# EAGLE design ME433_BB_SCHEM (EAGLE 9.6.2)
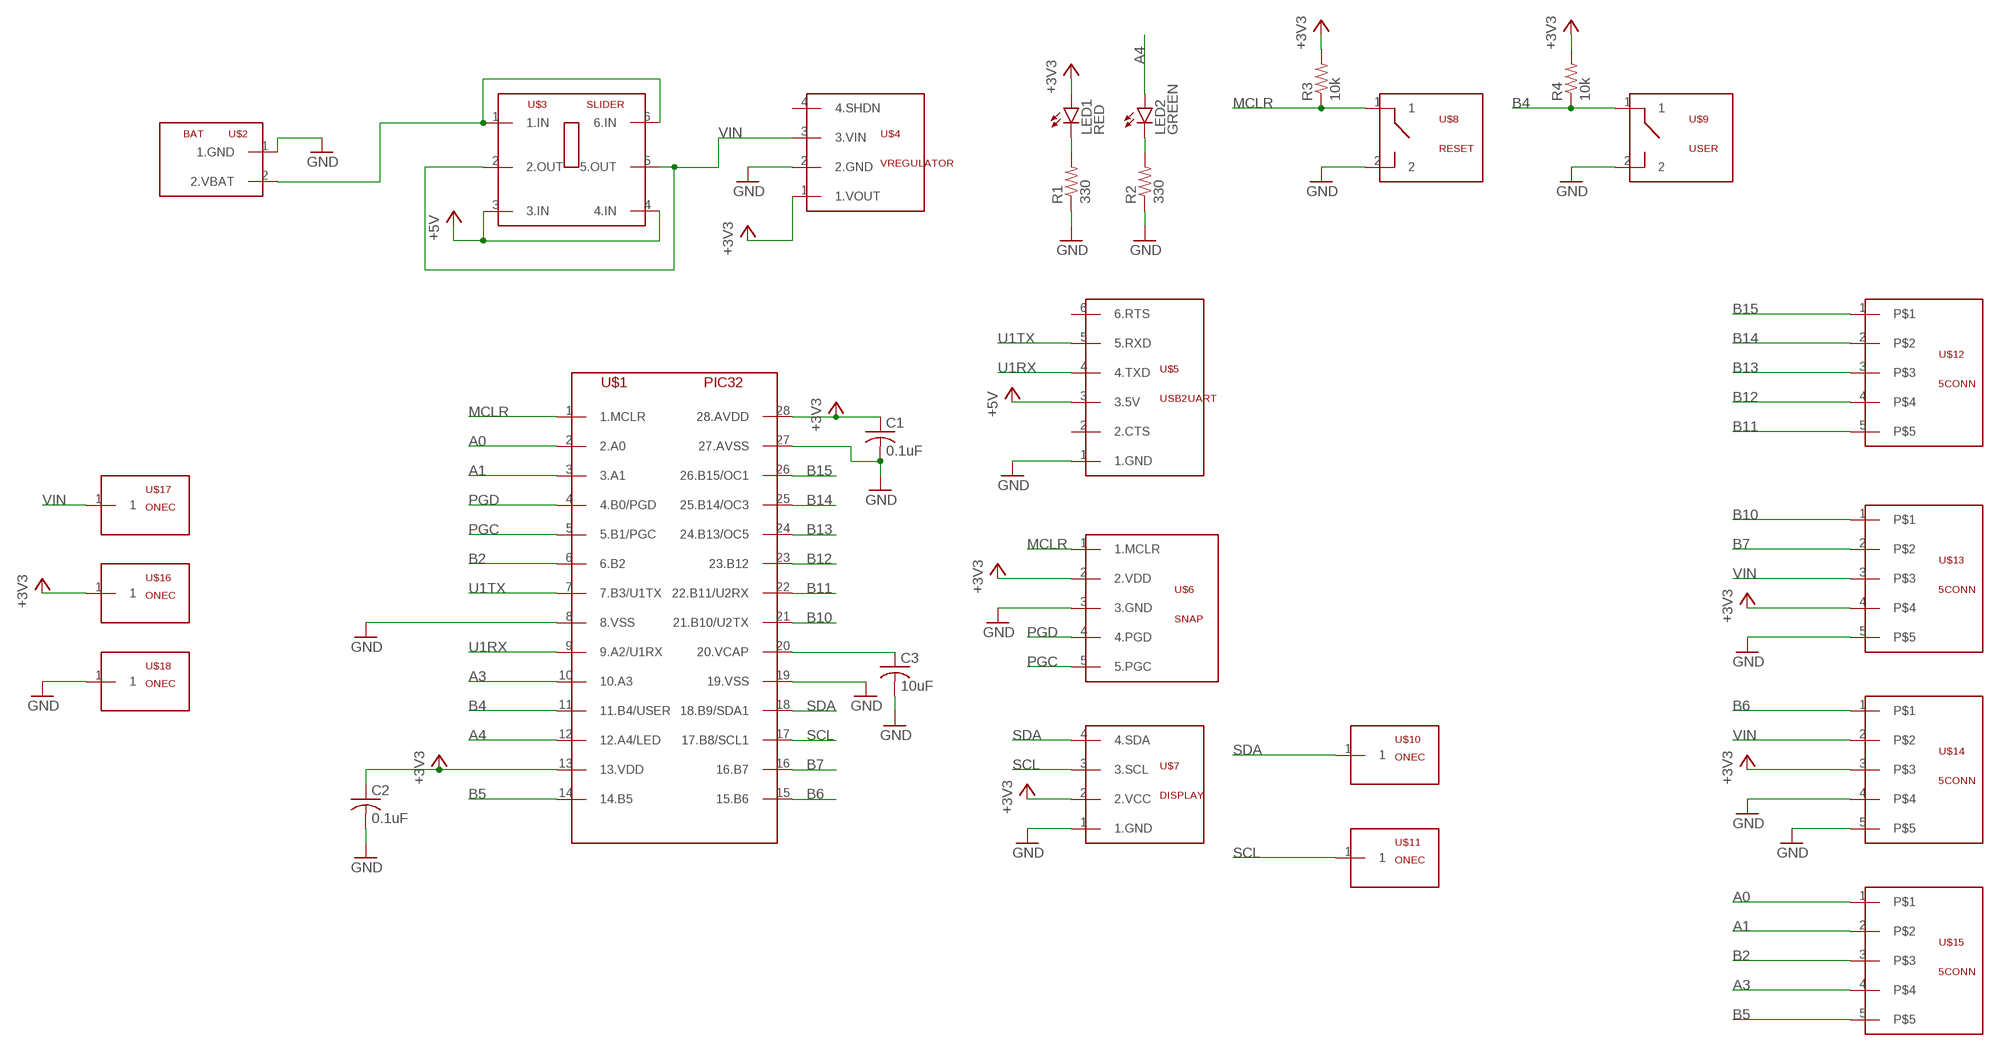
[diagram p0: schematic, sheet 1]

## Parts
C1  0.1uF  C-US025-024X044  [C025-024X044]
C2  0.1uF  C-US025-024X044  [C025-024X044]
C3  10uF  C-US025-024X044  [C025-024X044]
LED1  RED  LED3MM  [LED3MM]
LED2  GREEN  LED3MM  [LED3MM]
R1  330  R-US_0207/7  [0207/7]
R2  330  R-US_0207/7  [0207/7]
R3  10k  R-US_0207/7  [0207/7]
R4  10k  R-US_0207/7  [0207/7]
U$1  PIC32  [DIL28-3]
U$2  BAT  [BAT]
U$3  SLIDER  [SLIDER]
U$4  VREGULATOR  [VREGULATOR]
U$5  USB2UART  [USB2UART]
U$6  SNAP  [SNAP]
U$7  DISPLAY  [DISPLAY]
U$8  RESET  BUTT  [BUTT]
U$9  USER  BUTT  [BUTT]
U$10  ONEC  [ONEC]
U$11  ONEC  [ONEC]
U$12  5CONN  [5CONN]
U$13  5CONN  [5CONN]
U$14  5CONN  [5CONN]
U$15  5CONN  [5CONN]
U$16  ONEC  [ONEC]
U$17  ONEC  [ONEC]
U$18  ONEC  [ONEC]

## Nets
+3V3: C1.1 C2.1 LED1.A R3.2 R4.2 U$1.13(13.VDD) U$1.28(28.AVDD) U$4.1(1.VOUT) U$6.2(2.VDD) U$7.2(2.VCC) U$13.4 U$14.3 U$16.1
+5V: U$3.3(3.IN) U$3.4(4.IN) U$5.3(3.5V)
A0: U$1.2(2.A0) U$15.1
A1: U$1.3(3.A1) U$15.2
A3: U$1.10(10.A3) U$15.4
A4: LED2.A U$1.12(12.A4/LED)
B2: U$1.6(6.B2) U$15.3
B4: R4.1 U$1.11(11.B4/USER) U$9.1
B5: U$1.14(14.B5) U$15.5
B6: U$1.15(15.B6) U$14.1
B7: U$1.16(16.B7) U$13.2
B10: U$1.21(21.B10/U2TX) U$13.1
B11: U$1.22(22.B11/U2RX) U$12.5
B12: U$1.23(23.B12) U$12.4
B13: U$1.24(24.B13/OC5) U$12.3
B14: U$1.25(25.B14/OC3) U$12.2
B15: U$1.26(26.B15/OC1) U$12.1
GND: C1.2 C2.2 C3.2 R1.1 R2.1 U$1.8(8.VSS) U$1.19(19.VSS) U$1.27(27.AVSS) U$2.1(1.GND) U$4.2(2.GND) U$5.1(1.GND) U$6.3(3.GND) U$7.1(1.GND) U$8.2 U$9.2 U$13.5 U$14.4 U$14.5 U$18.1
MCLR: R3.1 U$1.1(1.MCLR) U$6.1(1.MCLR) U$8.1
N$1: LED1.K(C) R1.2
N$2: U$2.2(2.VBAT) U$3.1(1.IN) U$3.6(6.IN)
N$3: LED2.K(C) R2.2
N$5: C3.1 U$1.20(20.VCAP)
PGC: U$1.5(5.B1/PGC) U$6.5(5.PGC)
PGD: U$1.4(4.B0/PGD) U$6.4(4.PGD)
SCL: U$1.17(17.B8/SCL1) U$7.3(3.SCL) U$11.1
SDA: U$1.18(18.B9/SDA1) U$7.4(4.SDA) U$10.1
U1RX: U$1.9(9.A2/U1RX) U$5.4(4.TXD)
U1TX: U$1.7(7.B3/U1TX) U$5.5(5.RXD)
VIN: U$3.2(2.OUT) U$3.5(5.OUT) U$4.3(3.VIN) U$13.3 U$14.2 U$17.1
Unconnected: U$4.4(4.SHDN) U$5.2(2.CTS) U$5.6(6.RTS)

## Library data of the parts
C1-C3 = ME433_BB_library:C-US: CAPACITOR, American symbol; SPICEPREFIX: C
LED1 LED2 = ME433_BB_library:LED: LED OSRAM: - CHIPLED LG R971, LG N971, LY N971, LG Q971, LY Q971, LO R971, LY R971 LH N974, LH R974 LS Q976, LO Q976, LY Q976 LO Q996 - Hyper CHIPLED LW Q18S LB Q993, LB Q99A, LB R99A - SideLED LS A670, LO A670, LY A670, LG A670, LP A670 LB A673, LV A673, LT A673, LW A673 LH A674 LY A675 LS A676, LA A676, LO A676, LY A676, LW A676 LS A679, LY A679, LG A679 - Hyper Micro SIDELED® LS Y876, LA Y876, LO Y876, LY Y876 LT Y87S - SmartLED LW L88C, LW L88S LB L89C, LB L89S, LG L890 LS L89K, LO L89K, LY L89K LS L896, LA L896, LO L896, LY L896 - TOPLED LS T670, LO T670, LY T670, LG T670, LP T670 LSG T670, LSP T670, LSY T670, LOP T670, LYG T670 LG T671, LOG T671, LSG T671 LB T673, LV T673, LT T673, LW T673 LH T674 LS T676, LA T676, LO T676, LY T676, LB T676, LH T676, LSB T676, LW T676 LB T67C, LV T67C, LT T67C, LS T67K, LO T67K, LY T67K, LW E67C LS E67B, LA E67B, LO E67B, LY E67B, LB E67C, LV E67C, LT E67C LW T67C LS T679, LY T679, LG T679 LS T770, LO T770, LY T770, LG T770, LP T770 LB T773, LV T773, LT T773, LW T773 LH T774 LS E675, LA E675, LY E675, LS T675 LS T776, LA T776, LO T776, LY T776, LB T776 LHGB T686 LT T68C, LB T68C - Hyper Mini TOPLED® LB M676 - Mini TOPLED Santana® LG M470 LS M47K, LO M47K, LY M47K Source: http://www.osram.convergy.de LUXEON: - LUMILED® LXK2-PW12-R00, LXK2-PW12-S00, LXK2-PW14-U00, LXK2-PW14-V00 LXK2-PM12-R00, LXK2-PM12-S00, LXK2-PM14-U00 LXK2-PE12-Q00, LXK2-PE12-R00, LXK2-PE12-S00, LXK2-PE14-T00, LXK2-PE14-U00 LXK2-PB12-K00, LXK2-PB12-L00, LXK2-PB12-M00, LXK2-PB14-N00, LXK2-PB14-P00, LXK2-PB14-Q00 LXK2-PR12-L00, LXK2-PR12-M00, LXK2-PR14-Q00, LXK2-PR14-R00 LXK2-PD12-Q00, LXK2-PD12-R00, LXK2-PD12-S00 LXK2-PH12-R00, LXK2-PH12-S00 LXK2-PL12-P00, LXK2-PL12-Q00, LXK2-PL12-R00 Source: www.luxeon.com KINGBRIGHT: KA-3528ASYC Source: www.kingbright.com
R1-R4 = ME433_BB_library:R-US_: RESISTOR, American symbol; SPICEPREFIX: R
U$1 = ME433_BB_library:PIC32
U$2 = ME433_BB_library:BAT
U$3 = ME433_BB_library:SLIDER
U$4 = ME433_BB_library:VREGULATOR
U$5 = ME433_BB_library:USB2UART
U$6 = ME433_BB_library:SNAP
U$7 = ME433_BB_library:DISPLAY
U$8 U$9 = ME433_BB_library:BUTT
U$10 U$11 U$16-U$18 = ME433_BB_library:ONEC
U$12-U$15 = ME433_BB_library:5CONN

## Board
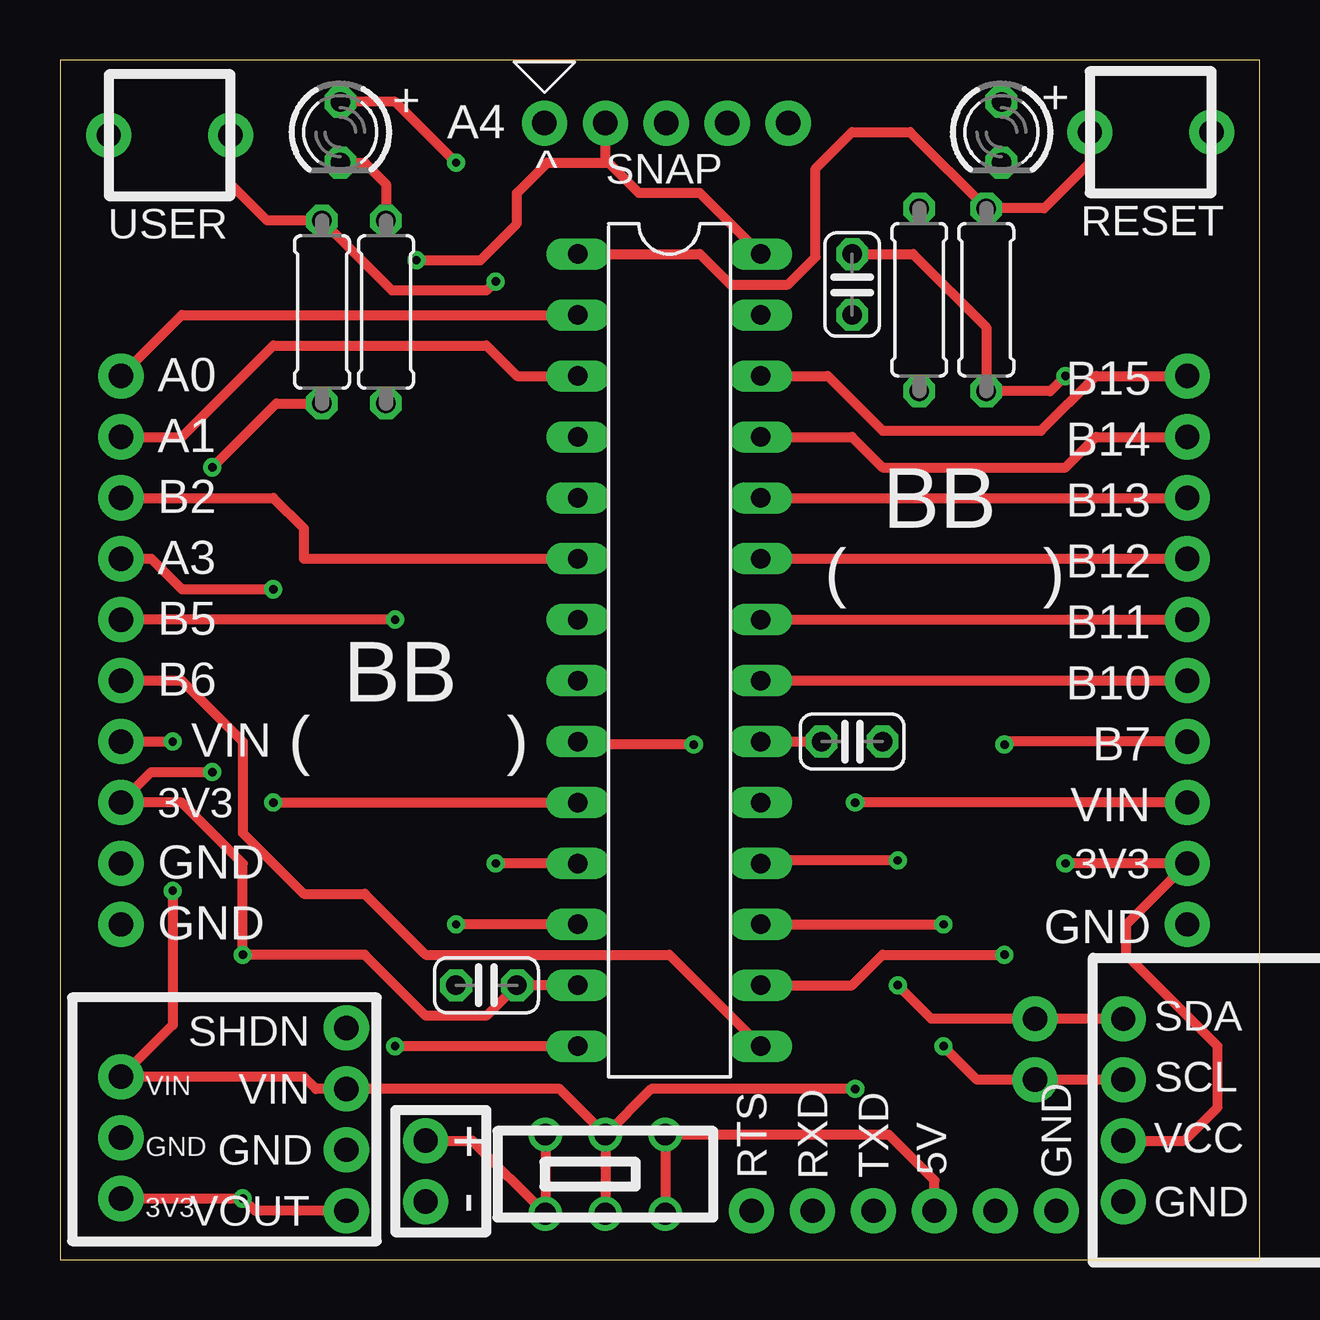
[diagram p1: board, top side]
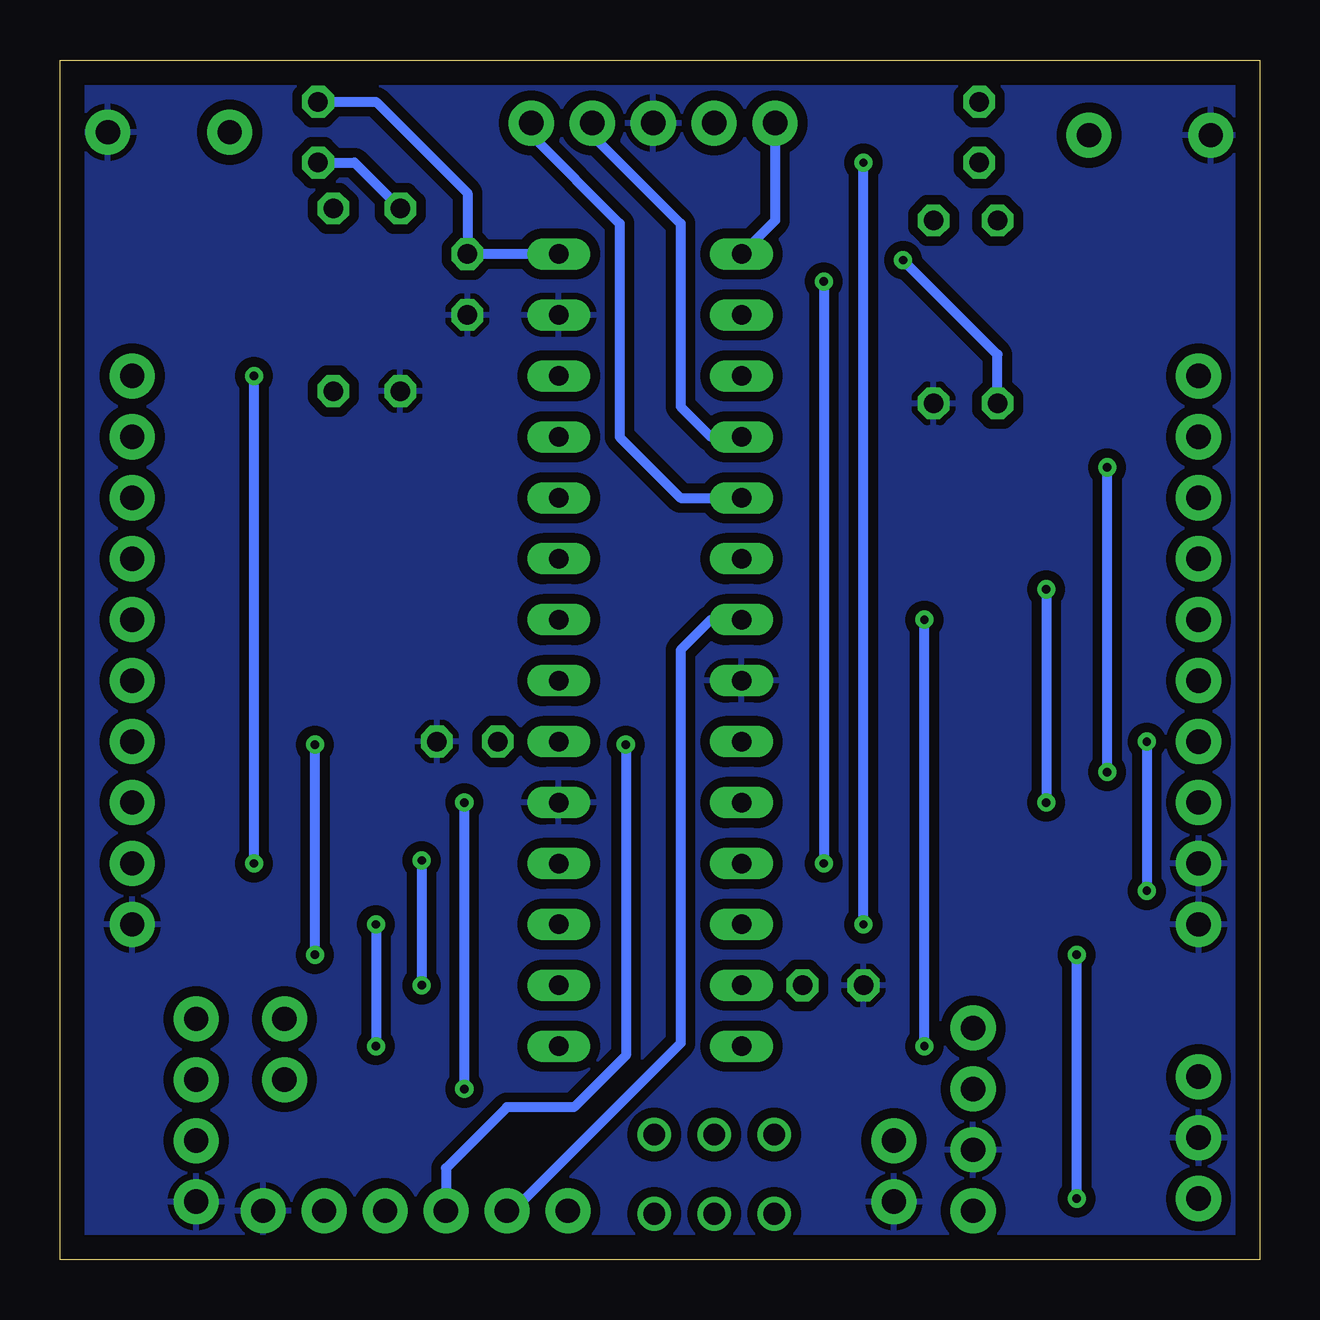
[diagram p2: board, bottom side, seen from below]

Size 50 x 50 mm. Coordinates in mm from the lower left corner, seen from the top.
Outline: 0,0 50,0 50,50 0,50 0,0
Copper layers (1*16): Top 0.035mm / dielectric 1.5mm / Bottom 0.035mm
Design rules "default": minimum track width 6mil, minimum drill 0.35mm, track to track 6mil, track to pad 6mil, pad to pad 6mil, via to via 6mil, smd to smd 6mil, copper to edge 40mil, drill to drill 6mil, minimum pad ring 10mil, minimum via ring 8mil, stop-mask expansion 4mil, vias tented up to drill 0mil, thermal gap 10mil

### Footprints (pad centres in the part's own frame; a part is rotated, then mirrored left to right if it is on the bottom)
C025-024X044 = drill 0.813 octagon: 1 -1.27,0; 2 1.27,0
LED3MM = drill 0.813 octagon: A -1.27,0; K 1.27,0
0207/7 = drill 0.813 octagon: 1 -3.81,0; 2 3.81,0
DIL28-3 = drill 0.813 long: 1 -16.51,-3.81; 2 -13.97,-3.81; 3 -11.43,-3.81; 4 -8.89,-3.81; 5 -6.35,-3.81; 6 -3.81,-3.81; 7 -1.27,-3.81; 8 1.27,-3.81; 9 3.81,-3.81; 10 6.35,-3.81; 11 8.89,-3.81; 12 11.43,-3.81; 13 13.97,-3.81; 14 16.51,-3.81; 15 16.51,3.81; 16 13.97,3.81; 17 11.43,3.81; 18 8.89,3.81; 19 6.35,3.81; 20 3.81,3.81; 21 1.27,3.81; 22 -1.27,3.81; 23 -3.81,3.81; 24 -6.35,3.81; 25 -8.89,3.81; 26 -11.43,3.81; 27 -13.97,3.81; 28 -16.51,3.81
BAT = drill 1.016 pad 1.88: 1 -1.27,0; 2 1.27,0
SLIDER = drill 0.9: 1 -2.5,-1.65; 2 0,-1.65; 3 2.5,-1.65; 4 2.5,1.65; 5 0,1.65; 6 -2.5,1.65
VREGULATOR = drill 1.016 pad 1.88: 1 -3.81,0; 2 -1.27,0; 3 1.27,0; 4 3.81,0
USB2UART = drill 1.016 pad 1.88: 1 -6.35,0; 2 -3.81,0; 3 -1.27,0; 4 1.27,0; 5 3.81,0; 6 6.35,0
SNAP = drill 1.016 pad 1.88: 1 -5.08,0; 2 -2.54,0; 3 0,0; 4 2.54,0; 5 5.08,0
DISPLAY = drill 1.016 pad 1.88: 1 0,-3.81; 2 0,-1.27; 3 0,1.27; 4 0,3.81
BUTT = drill 1.016 pad 1.88: 1 -2.54,0; 2 2.54,0
ONEC = drill 1.016 pad 1.88: 1 0,0
5CONN = drill 1.016 pad 1.88: 1 -5.08,0; 2 -2.54,0; 3 0,0; 4 2.54,0; 5 5.08,0

### Placement (x,y rotation side)
C1  33.02,40.64 270 top
C2  17.78,11.43 180 top
C3  33.02,21.59 0 top
LED1  39.24,46.99 270 top
LED2  11.68,46.99 270 top
R1  35.81,40.01 90 top
R2  13.59,39.5 90 top
R3  38.61,40.01 270 top
R4  10.92,39.5 270 top
U$1  25.4,25.4 270 top
U$2  15.24,3.68 90 top
U$3  22.73,3.56 0 top
U$4  11.94,5.84 90 top
U$5  35.18,2.03 180 top
U$6  25.27,47.37 0 top
U$7  44.32,6.22 0 top
U$8  45.47,46.99 0 top
U$9  4.57,46.86 180 top
U$10  40.64,10.03 0 top
U$11  40.64,7.49 0 top
U$12  46.99,31.75 270 top
U$13  46.99,19.05 270 top
U$14  2.54,19.05 270 top
U$15  2.54,31.75 270 top
U$16  2.54,2.54 0 top
U$17  2.54,7.62 0 top
U$18  2.54,5.08 0 top

### Tracks (layer width: path | path; a pad name or v marks a point on that pad's centre or on a via)
+3V3  (via drill 0.35)
  Top 0.406: U$1.13 C2.1 17.78,10.16 15.24,10.16 12.7,12.7 v7.62,12.7 7.62,16.51 5.08,19.05 U$14.3 3.81,20.32 v6.35,20.32 | C1.1 35.56,41.91 38.61,38.86 R3.2 41.27,36.2 v41.91,36.83 | U$7.2 46.86,4.95 48.26,6.35 48.26,8.89 44.45,12.7 44.45,13.97 U$13.4 v41.91,16.51 | U$4.1 8.13,2.03 v7.62,2.54 U$16.1 | U$1.28 26.67,44.45 24.13,44.45 22.86,45.72 | 22.86,45.72 22.73,45.85 U$6.2 | v6.35,33.02 9.02,35.69 R4.2 | v14.86,41.66 17.53,41.66 19.05,43.18 19.05,44.45 20.32,45.72 22.86,45.72
  Bottom 0.406: U$1.28 C1.1 33.02,44.45 36.83,48.26 LED1.A | v7.62,2.54 v7.62,12.7 | v41.91,16.51 v41.91,36.83 | v6.35,20.32 v6.35,33.02 | R4.2 10.92,37.72 v14.86,41.66
+5V
  Top 0.406: U$3.3 U$3.4 34.55,5.21 36.45,3.3 U$5.3
A0
  Top 0.406: U$15.1 5.08,39.37 U$1.2
A1
  Top 0.406: U$15.2 5.08,34.29 8.89,38.1 17.78,38.1 19.05,36.83 U$1.3
A3  (via drill 0.35)
  Top 0.406: v8.89,27.94 5.08,27.94 3.81,29.21 U$15.4 | v8.89,19.05 U$1.10
  Bottom 0.406: v8.89,27.94 v8.89,19.05
A4  (via drill 0.35)
  Top 0.406: U$1.12 v16.51,13.97 | v16.51,45.72 13.97,48.26 LED2.A
  Bottom 0.406: v16.51,13.97 v16.51,45.72
B2
  Top 0.406: U$15.3 8.89,31.75 10.16,30.48 10.16,29.21 U$1.6
B4  (via drill 0.35)
  Top 0.406: U$9.1 7.11,44.83 8.64,43.31 R4.1 13.84,40.39 17.78,40.39 v18.16,40.77 | U$1.11 v18.16,16.51
  Bottom 0.406: v18.16,40.77 v18.16,16.51
B5  (via drill 0.35)
  Top 0.406: U$1.14 v13.97,8.89 | v13.97,26.67 U$15.5
  Bottom 0.406: v13.97,8.89 v13.97,26.67
B6
  Top 0.406: U$14.1 5.08,24.13 7.62,21.59 7.62,17.78 10.16,15.24 12.7,15.24 15.24,12.7 25.4,12.7 U$1.15
B7  (via drill 0.35)
  Top 0.406: U$1.16 33.02,11.43 34.29,12.7 v39.37,12.7 | U$13.2 39.5,21.59 v39.37,21.46
  Bottom 0.406: v39.37,12.7 v39.37,21.46
B10
  Top 0.406: U$1.21 U$13.1
B11
  Top 0.406: U$1.22 U$12.5
B12
  Top 0.406: U$1.23 U$12.4
B13
  Top 0.406: U$1.24 U$12.3
B14
  Top 0.406: U$1.25 33.02,34.29 34.29,33.02 41.91,33.02 43.18,34.29 U$12.2
B15
  Top 0.406: U$1.26 32,36.83 34.29,34.54 40.89,34.54 43.18,36.83 U$12.1
GND
  pour Bottom (isolate 0.406): 0,0 50.8,0 50.8,50.8 0,50.8
MCLR
  Top 0.406: U$8.1 42.93,45.72 41.02,43.81 R3.1 35.43,46.99 33.02,46.99 31.5,45.47 31.5,41.78 30.35,40.64 27.94,40.64 26.67,41.91 U$1.1
  Bottom 0.406: U$6.1 20.19,43.31 U$1.1
N$1
  Bottom 0.406: R1.2 37.72,45.72 LED1.K
N$2
  Top 0.406: U$3.6 U$3.1 17.19,4.95 U$2.2
N$3
  Top 0.406: LED2.K 12.7,45.72 13.59,44.83 R2.2
N$5
  Top 0.406: U$1.20 C3.1
PGC
  Bottom 0.406: U$6.5 30.35,46.86 26.67,43.18 26.67,34.29 24.13,31.75 U$1.5
PGD
  Bottom 0.406: U$6.4 27.81,46.86 24.13,43.18 24.13,35.56 22.86,34.29 U$1.4
SCL  (via drill 0.35)
  Top 0.406: U$1.17 v36.83,13.97 | v36.83,8.89 38.23,7.49 U$11.1 U$7.3
  Bottom 0.406: v36.83,13.97 v36.83,8.89
SDA  (via drill 0.35)
  Top 0.406: v34.92,16.64 29.34,16.64 U$1.18 | v34.92,11.43 36.32,10.03 U$10.1 U$7.4
  Bottom 0.406: v34.92,16.64 v34.92,11.43
U1RX  (via drill 0.35)
  Top 0.406: v26.42,21.46 21.72,21.46 U$1.9
  Bottom 0.406: v26.42,21.46 26.42,8.51 28.57,6.35 31.37,6.35 33.91,3.81 U$5.4
U1TX
  Bottom 0.406: U$1.7 22.86,26.67 24.13,25.4 24.13,9.02 31.11,2.03 U$5.5
VIN  (via drill 0.35)
  Top 0.406: U$3.5 U$3.2 | U$3.5 20.83,7.11 U$4.3 10.67,7.11 10.16,7.62 U$17.1 4.7,9.78 v4.7,15.37 | U$3.5 24.64,7.11 v33.15,7.11 | U$13.3 v33.15,19.05 | U$14.2 v4.7,21.59
  Bottom 0.406: v33.15,19.05 v33.15,7.11 | v4.7,21.59 v4.7,15.37

### Text on the board
tPlace: + | + | A4 | ^ | B15 | A0 | B14 | A1 | B13 | B2 | BB | B12 | A3 | (◕‿◕✿) | B11 | B5 | B10 | B6 | BB | B7 | VIN | (◡‿◡✿) | VIN | 3V3 | 3V3 | GND | GND | GND | VIN | GND | 3V3